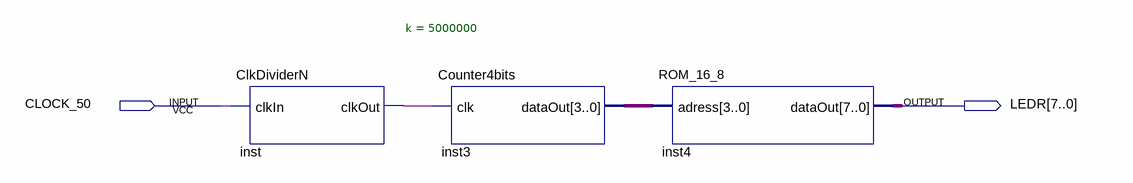
[diagram p0: schematic sheet]
// Quartus schematic ROM_Demo.bdf as structural Verilog: 3 symbols, 2 pins
module ROM_Demo (
  input  CLOCK_50,
  output [7:0] LEDR
);

  wire inst_clkout;
  wire [3:0] inst3_dataout;

  ClkDividerN #(.k(5000000)) inst (.clkIn(CLOCK_50), .clkOut(inst_clkout));
  Counter4bits inst3 (.clk(inst_clkout), .dataOut(inst3_dataout));
  ROM_16_8 inst4 (.adress(inst3_dataout), .dataOut(LEDR));
endmodule
